# Altium schematic sheet driver_am26c31_isolated.SchDoc
size A; SheetNumber: 14
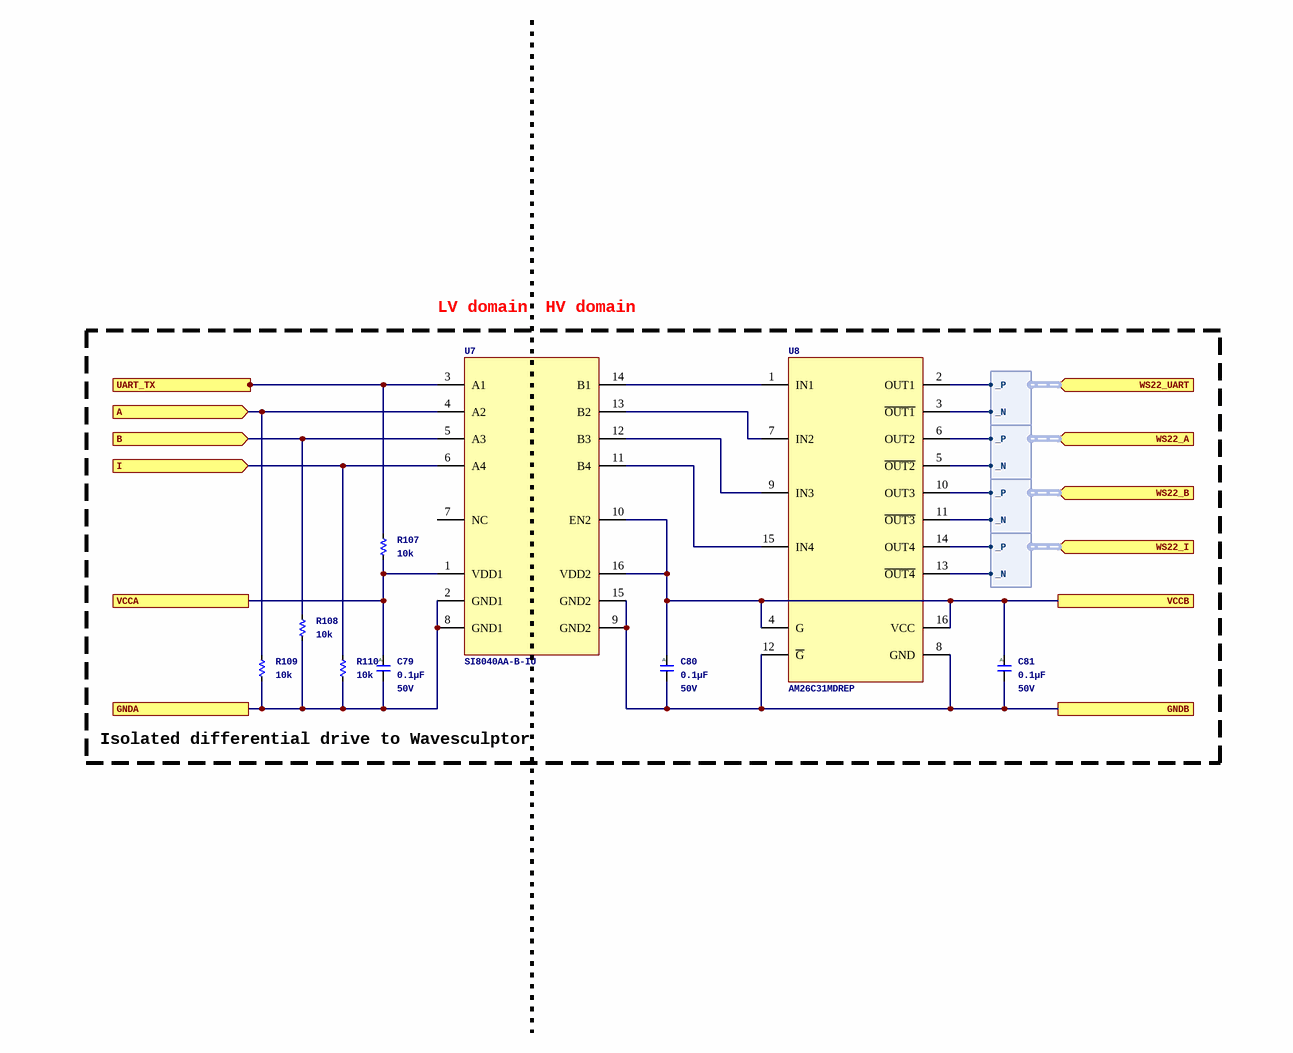
[diagram p0: driver_am26c31_isolated.SchDoc]

## Parts
C79  Capacitance: 0.1µF  Voltage - Rated: 50V  [C0402_0.55MM]  (hidden comment: CGA2B3X7R1H104M050BB)
C80  Capacitance: 0.1µF  Voltage - Rated: 50V  [C0402_0.55MM]  (hidden comment: CGA2B3X7R1H104M050BB)
C81  Capacitance: 0.1µF  Voltage - Rated: 50V  [C0402_0.55MM]  (hidden comment: CGA2B3X7R1H104M050BB)
R107  Resistance: 10k  [R0402_0.40MM]  (hidden comment: ERJ-2RKF1002X)
R108  Resistance: 10k  [R0402_0.40MM]  (hidden comment: ERJ-2RKF1002X)
R109  Resistance: 10k  [R0402_0.40MM]  (hidden comment: ERJ-2RKF1002X)
R110  Resistance: 10k  [R0402_0.40MM]  (hidden comment: ERJ-2RKF1002X)
U7  SI8040AA-B-IU  [16SSOP635]
U8  AM26C31MDREP  [16SOIC150]

## Ports
A (in), B (in), GNDA, GNDB, I (in), UART_TX (in), VCCA, VCCB, WS22_A (in, harness DIFF), WS22_B (in, harness DIFF), WS22_I (in, harness DIFF), WS22_UART (in, harness DIFF)

## Harnesses
DIFF: _P, _N

## Nets
A: R109.2 U7.4(A2) ; port A
B: R108.2 U7.5(A3) ; port B
GNDA: C79.2 R108.1 R109.1 R110.1 U7.2(GND1) U7.8(GND1) ; port GNDA
GNDB: C80.2 C81.2 U7.9(GND2) U7.15(GND2) U8.8(GND) U8.12(~{G}) ; port GNDB
I: R110.2 U7.6(A4) ; port I
UART_TX: R107.2 U7.3(A1) ; port UART_TX
VCCA: C79.1 R107.1 U7.1(VDD1) ; port VCCA
VCCB: C80.1 C81.1 U7.10(EN2) U7.16(VDD2) U8.4(G) U8.16(VCC) ; port VCCB
NetU7_11: U7.11(B4) U8.15(IN4)
NetU7_12: U7.12(B3) U8.9(IN3)
NetU7_13: U7.13(B2) U8.7(IN2)
NetU7_14: U7.14(B1) U8.1(IN1)
NetU8_2: U8.2(OUT1) ; port WS22_UART._P
NetU8_3: U8.3(~{OUT1}) ; port WS22_UART._N
NetU8_5: U8.5(~{OUT2}) ; port WS22_A._N
NetU8_6: U8.6(OUT2) ; port WS22_A._P
NetU8_10: U8.10(OUT3) ; port WS22_B._P
NetU8_11: U8.11(~{OUT3}) ; port WS22_B._N
NetU8_13: U8.13(~{OUT4}) ; port WS22_I._N
NetU8_14: U8.14(OUT4) ; port WS22_I._P

Not connected (* = marked no-connect by the designer): U7 7(NC)

## Notes on the sheet
- LV domain
- HV domain
- Isolated differential drive to Wavesculptor
- (in symbol CGA2B3X7R1H104M050BB) A

## Library data of the parts
C79-C81 = CGA2B3X7R1H104M050BB: CAP CER 0.1UF 50V X7R 0402; Manufacturer: TDK Corporation; Unit Price (USD): 0.17; Tolerance: ±20%; ComponentLink1URL: https://product.tdk.com/info/en/catalog/datasheets/mlcc_automotive_general_en.pdf?ref_disty=digikey; ComponentLink1Description: Series Datasheet; Series: CGA; Part Status: Active; Temperature Coefficient: X7R; Operating Temperature: -55°C ~ 125°C; Applications: AEC-Q200; Mounting Type: Surface Mount, MLCC; Package / Case: 0402 (1005 Metric); Size / Dimension: 0.039" L x 0.020" W (1.00mm x 0.50mm); Thickness (Max): 0.022" (0.55mm); Supplier 1: Digikey; Supplier Part Number 1: 445-12271-1-ND; Manufacturer Part Number: CGA2B3X7R1H104M050BB
R107-R110 = ERJ-2RKF1002X: RES SMD 10K OHM 1% 1/10W 0402; Manufacturer: Panasonic Electronic Components; Unit Price (USD): 0.1; Power (Watts): 0.1W, 1/10W; Temperature Coefficient: ±100ppm/°C; ComponentLink1Description: Datasheet; ComponentLink1URL: https://industrial.panasonic.com/cdbs/www-data/pdf/RDA0000/AOA0000C304.pdf; Series: ERJ; Tolerance: ±1%; Composition: Thick Film; Features: Automotive AEC-Q200; Operating Temperature: -55°C ~ 155°C; Package / Case: 0402 (1005 Metric); Supplier Device Package: 0402; Size / Dimension: 0.039" L x 0.020" W (1.00mm x 0.50mm); Height - Seated (Max): 0.016" (0.40mm); Supplier 1: Digikey; Supplier Part Number 1: P10.0KLCT-ND; Manufacturer Part Number: ERJ-2RKF1002X
U7 = ISO_SI8040AA-B-IU: 4 ch 1 kV digital isolator; Manufacturer: Skyworks Solutions; Supplier 1: Digikey; Supplier Part Number 1: 336-5446-ND; Manufacturer Part Number: SI8040AA-B-IU; Supplier 2: LCSC; Supplier Part Number 2: C6296431; ComponentLink1Description: Datasheet; ComponentLink1URL: https://www.skyworksinc.com/-/media/Skyworks/SL/documents/public/data-sheets/Si80xx-1kV.pdf
U8 = RS422_AM26C31QDR: IC QUAD DIFF LINE DRIVER 16-SOIC; Manufacturer: Texas Instruments; Supplier 1: Digikey; ComponentLink1URL: https://www.ti.com/lit/ds/symlink/am26c31.pdf; ComponentLink1Description: Datasheet; Supplier Part Number 1: 296-41199-1-ND; Manufacturer Part Number: AM26C31MDREP; Supplier 2: LCSC; Supplier Part Number 2: C337769